# EAGLE schematic PowerCable (EAGLE 6.4)
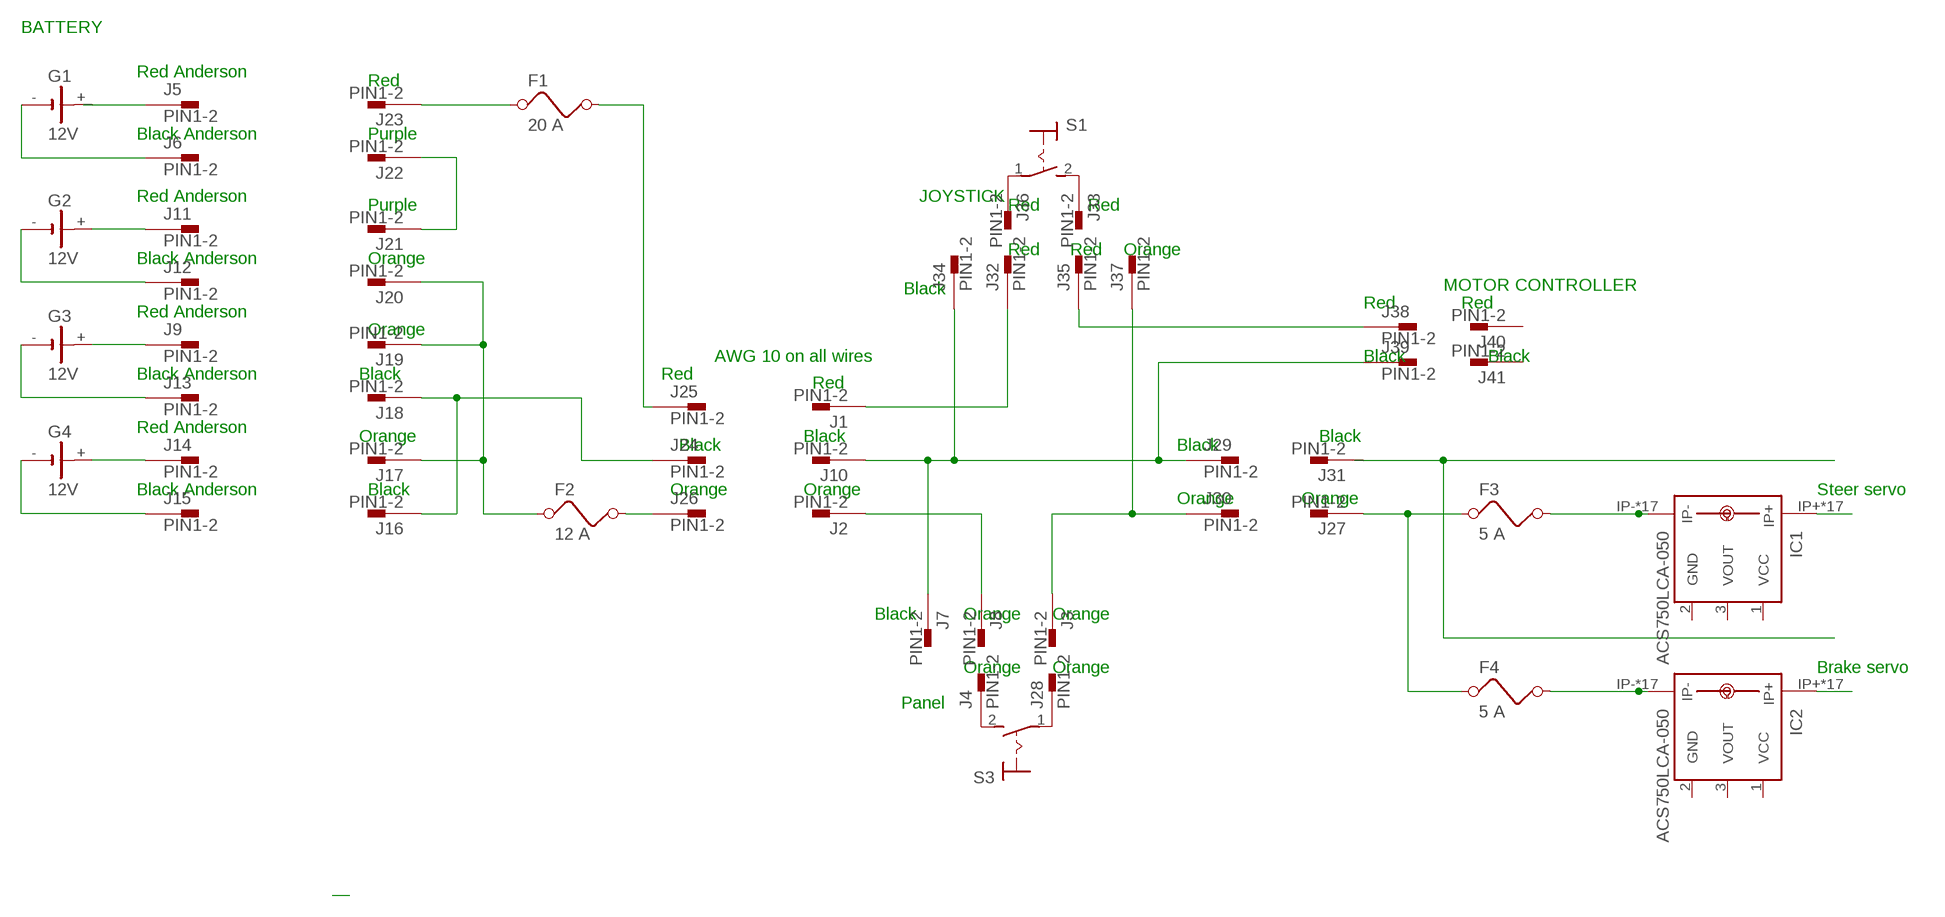
[diagram p0: schematic, sheet 1]

## Parts
F1  20 A  FUSE  [FUSE]
F2  12 A  FUSE  [FUSE]
F3  5 A  FUSE  [FUSE]
F4  5 A  FUSE  [FUSE]
G1  12V  SL-150-1/2AA/PR  [SL-150-1/2AA/PR]
G2  12V  SL-150-1/2AA/PR  [SL-150-1/2AA/PR]
G3  12V  SL-150-1/2AA/PR  [SL-150-1/2AA/PR]
G4  12V  SL-150-1/2AA/PR  [SL-150-1/2AA/PR]
IC1  ACS750LCA-050  [ACS75050]
IC2  ACS750LCA-050  [ACS75050]
J1  PIN1-2  [62221]
J2  PIN1-2  [62221]
J3  PIN1-2  [62221]
J4  PIN1-2  [62221]
J5  PIN1-2  [62221]
J6  PIN1-2  [62221]
J7  PIN1-2  [62221]
J8  PIN1-2  [62221]
J9  PIN1-2  [62221]
J10  PIN1-2  [62221]
J11  PIN1-2  [62221]
J12  PIN1-2  [62221]
J13  PIN1-2  [62221]
J14  PIN1-2  [62221]
J15  PIN1-2  [62221]
J16  PIN1-2  [62221]
J17  PIN1-2  [62221]
J18  PIN1-2  [62221]
J19  PIN1-2  [62221]
J20  PIN1-2  [62221]
J21  PIN1-2  [62221]
J22  PIN1-2  [62221]
J23  PIN1-2  [62221]
J24  PIN1-2  [62221]
J25  PIN1-2  [62221]
J26  PIN1-2  [62221]
J27  PIN1-2  [62221]
J28  PIN1-2  [62221]
J29  PIN1-2  [62221]
J30  PIN1-2  [62221]
J31  PIN1-2  [62221]
J32  PIN1-2  [62221]
J33  PIN1-2  [62221]
J34  PIN1-2  [62221]
J35  PIN1-2  [62221]
J36  PIN1-2  [62221]
J37  PIN1-2  [62221]
J38  PIN1-2  [62221]
J39  PIN1-2  [62221]
J40  PIN1-2  [62221]
J41  PIN1-2  [62221]
S1  MS243  [MS243]
S3  MS243  [MS243]

## Nets
N$2: J7.1 J10.1 J29.1 J34.1 J39.1
N$3: J5.1
N$4: G1.- J6.1
N$5: J2.1 J8.1
N$6: J4.1 S3.2(S)
N$7: G2.+ J11.1
N$8: G2.- J12.1
N$9: J28.1 S3.1(P)
N$10: G3.+ J9.1
N$11: J3.1 J30.1 J37.1
N$12: F3.1 F4.1 J27.1
N$13: G3.- J13.1
N$14: G4.+ J14.1
N$15: G4.- J15.1
N$16: F3.2 IC1.IP- IC1.IP-@2(IP-) IC1.IP-@3(IP-) IC1.IP-@4(IP-) IC1.IP-@5(IP-) IC1.IP-@6(IP-) IC1.IP-@7(IP-) IC1.IP-@8(IP-) IC1.IP-@9(IP-) IC1.IP-@10(IP-) IC1.IP-@11(IP-) IC1.IP-@12(IP-) IC1.IP-@13(IP-) IC1.IP-@14(IP-) IC1.IP-@15(IP-) IC1.IP-@16(IP-) IC1.IP-@17(IP-)
N$17: J16.1 J18.1 J24.1
N$18: F1.1 J23.1
N$19: F1.2 J25.1
N$20: F4.2 IC2.IP- IC2.IP-@2(IP-) IC2.IP-@3(IP-) IC2.IP-@4(IP-) IC2.IP-@5(IP-) IC2.IP-@6(IP-) IC2.IP-@7(IP-) IC2.IP-@8(IP-) IC2.IP-@9(IP-) IC2.IP-@10(IP-) IC2.IP-@11(IP-) IC2.IP-@12(IP-) IC2.IP-@13(IP-) IC2.IP-@14(IP-) IC2.IP-@15(IP-) IC2.IP-@16(IP-) IC2.IP-@17(IP-)
N$21: F2.2 J26.1
N$23: IC2.IP+ IC2.IP+@2(IP+) IC2.IP+@3(IP+) IC2.IP+@4(IP+) IC2.IP+@5(IP+) IC2.IP+@6(IP+) IC2.IP+@7(IP+) IC2.IP+@8(IP+) IC2.IP+@9(IP+) IC2.IP+@10(IP+) IC2.IP+@11(IP+) IC2.IP+@12(IP+) IC2.IP+@13(IP+) IC2.IP+@14(IP+) IC2.IP+@15(IP+) IC2.IP+@16(IP+) IC2.IP+@17(IP+)
N$24: IC1.IP+ IC1.IP+@2(IP+) IC1.IP+@3(IP+) IC1.IP+@4(IP+) IC1.IP+@5(IP+) IC1.IP+@6(IP+) IC1.IP+@7(IP+) IC1.IP+@8(IP+) IC1.IP+@9(IP+) IC1.IP+@10(IP+) IC1.IP+@11(IP+) IC1.IP+@12(IP+) IC1.IP+@13(IP+) IC1.IP+@14(IP+) IC1.IP+@15(IP+) IC1.IP+@16(IP+) IC1.IP+@17(IP+)
N$25: J1.1 J32.1
N$26: J17.1 J19.1 J20.1
N$27: J21.1 J22.1
N$28: J35.1 J38.1
N$29: J33.1 S1.2(S)
N$30: J36.1 S1.1(P)
Unconnected: F2.1 G1.+ IC1.3(VOUT) IC2.3(VOUT) J31.1 J40.1 J41.1

## Notes on the sheet
- BATTERY
- Red Anderson
- Red
- Black Anderson | Purple
- Red Anderson | JOYSTICK
- Purple | Red | Red
- Red | Red | Orange
- Black Anderson | Orange
- Black
- MOTOR CONTROLLER
- Red | Red
- Red Anderson
- Orange
- AWG 10 on all wires | Black | Black
- Black Anderson | Black | Red
- Red
- Red Anderson
- Orange | Black | Black
- Black | Black
- Black Anderson | Black | Orange | Orange | Steer servo
- Orange | Orange
- Black | Orange | Orange
- Orange | Orange | Brake servo
- Panel

## Power pins joined to a net without a drawn wire
GND: IC1.2(GND) IC2.2(GND)
VCC: IC1.1(VCC) IC2.1(VCC)

## Library data of the parts
F1-F4 = special:FUSE: FUSE 5 x 20 mm
G1-G4 = battery:SL-150-1/2AA/PR: LI BATTERY Sonnenschein
IC1 IC2 = allegro:ACS750*CA-050: Current Sensor display layer 49 Reference in BRD and place VIAs on circles Source: www.allegromicro.com/datafile/0750-050.pdf; MF: ALLEGRO MICROSYSTEMS, INC.; MPN: ACS750LCA-050; OC_FARNELL: 1457176; OC_NEWARK: 61H4464
J1-J41 = con-faston:PIN1-2: CONN TAB FASTON BRASS .187 PCB TAB, FSSTON, DUAL STAKE, .187 SERIES Digi-Key Part Number: A24734CT-ND Source: Tyco Electronics Corporation .. ENG_CD_62221_R.pdf http://search.digikey.com/scripts/DkSearch/dksus.dll?Detail&name=A24734CT-ND; MF: TYCO ELECTRONICS; MPN: 62221-1; OC_FARNELL: unknown; OC_NEWARK: 16H2318
S1 S3 = switch:MS243: TOGGLE SWITCH